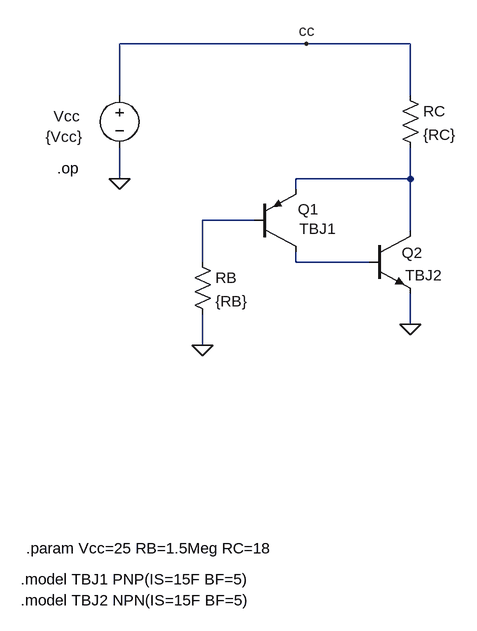
[diagram p0: schematic COMB04op.asc]
COMB04op.asc, the LTspice schematic file:
Version 4
SHEET 1 1608 1076
WIRE 1024 -144 736 -144
WIRE 1184 -144 1024 -144
WIRE 736 -64 736 -144
WIRE 1184 -64 1184 -144
WIRE 736 64 736 16
WIRE 1184 64 1184 16
WIRE 1184 64 1008 64
WIRE 1008 80 1008 64
WIRE 944 128 864 128
WIRE 1184 144 1184 64
WIRE 864 192 864 128
WIRE 1008 192 1008 176
WIRE 1120 192 1008 192
WIRE 1184 288 1184 240
WIRE 864 320 864 272
FLAG 1184 288 0
FLAG 736 64 0
FLAG 1024 -144 cc
FLAG 864 320 0
SYMBOL res 1168 -80 R0
SYMATTR InstName RC
SYMATTR Value {RC}
SYMBOL voltage 736 -80 R0
WINDOW 123 0 0 Left 0
WINDOW 39 0 0 Left 0
WINDOW 0 -101 48 Left 2
WINDOW 3 -114 79 Left 2
SYMATTR InstName Vcc
SYMATTR Value {Vcc}
SYMBOL npn 1120 144 R0
WINDOW 0 51 34 Left 2
SYMATTR InstName Q2
SYMATTR Value TBJ2
SYMBOL pnp 944 176 M180
WINDOW 0 67 65 Left 2
WINDOW 3 69 35 Left 2
SYMATTR InstName Q1
SYMATTR Value TBJ1
SYMBOL res 848 176 R0
SYMATTR InstName RB
SYMATTR Value {RB}
TEXT 640 48 Left 2 !.op
TEXT 592 632 Left 2 !.param Vcc=25 RB=1.5Meg RC=18
TEXT 584 680 Left 2 !.model TBJ1 PNP(IS=15F BF=5)
TEXT 584 712 Left 2 !.model TBJ2 NPN(IS=15F BF=5)

The netlist it stands for:
* COMB04op.asc
RC cc N001 {RC}
Vcc cc 0 {Vcc}
Q2 N001 N003 0 0 TBJ2
Q1 N003 N002 N001 0 TBJ1
RB N002 0 {RB}
.model NPN NPN
.model PNP PNP
.lib standard.bjt
.op
.param Vcc=25 RB=1.5Meg RC=18
.model TBJ1 PNP(IS=15F BF=5)
.model TBJ2 NPN(IS=15F BF=5)
.backanno
.end